# EasyEDA schematic SCH_Voltage Regulator_2023-12-21.json
TITLE: Sheet_1; REV: 1.0; Date: 2023-12-19; Sheet: 1/1; Drawn By: nehafrancis2003; Company: Your Company
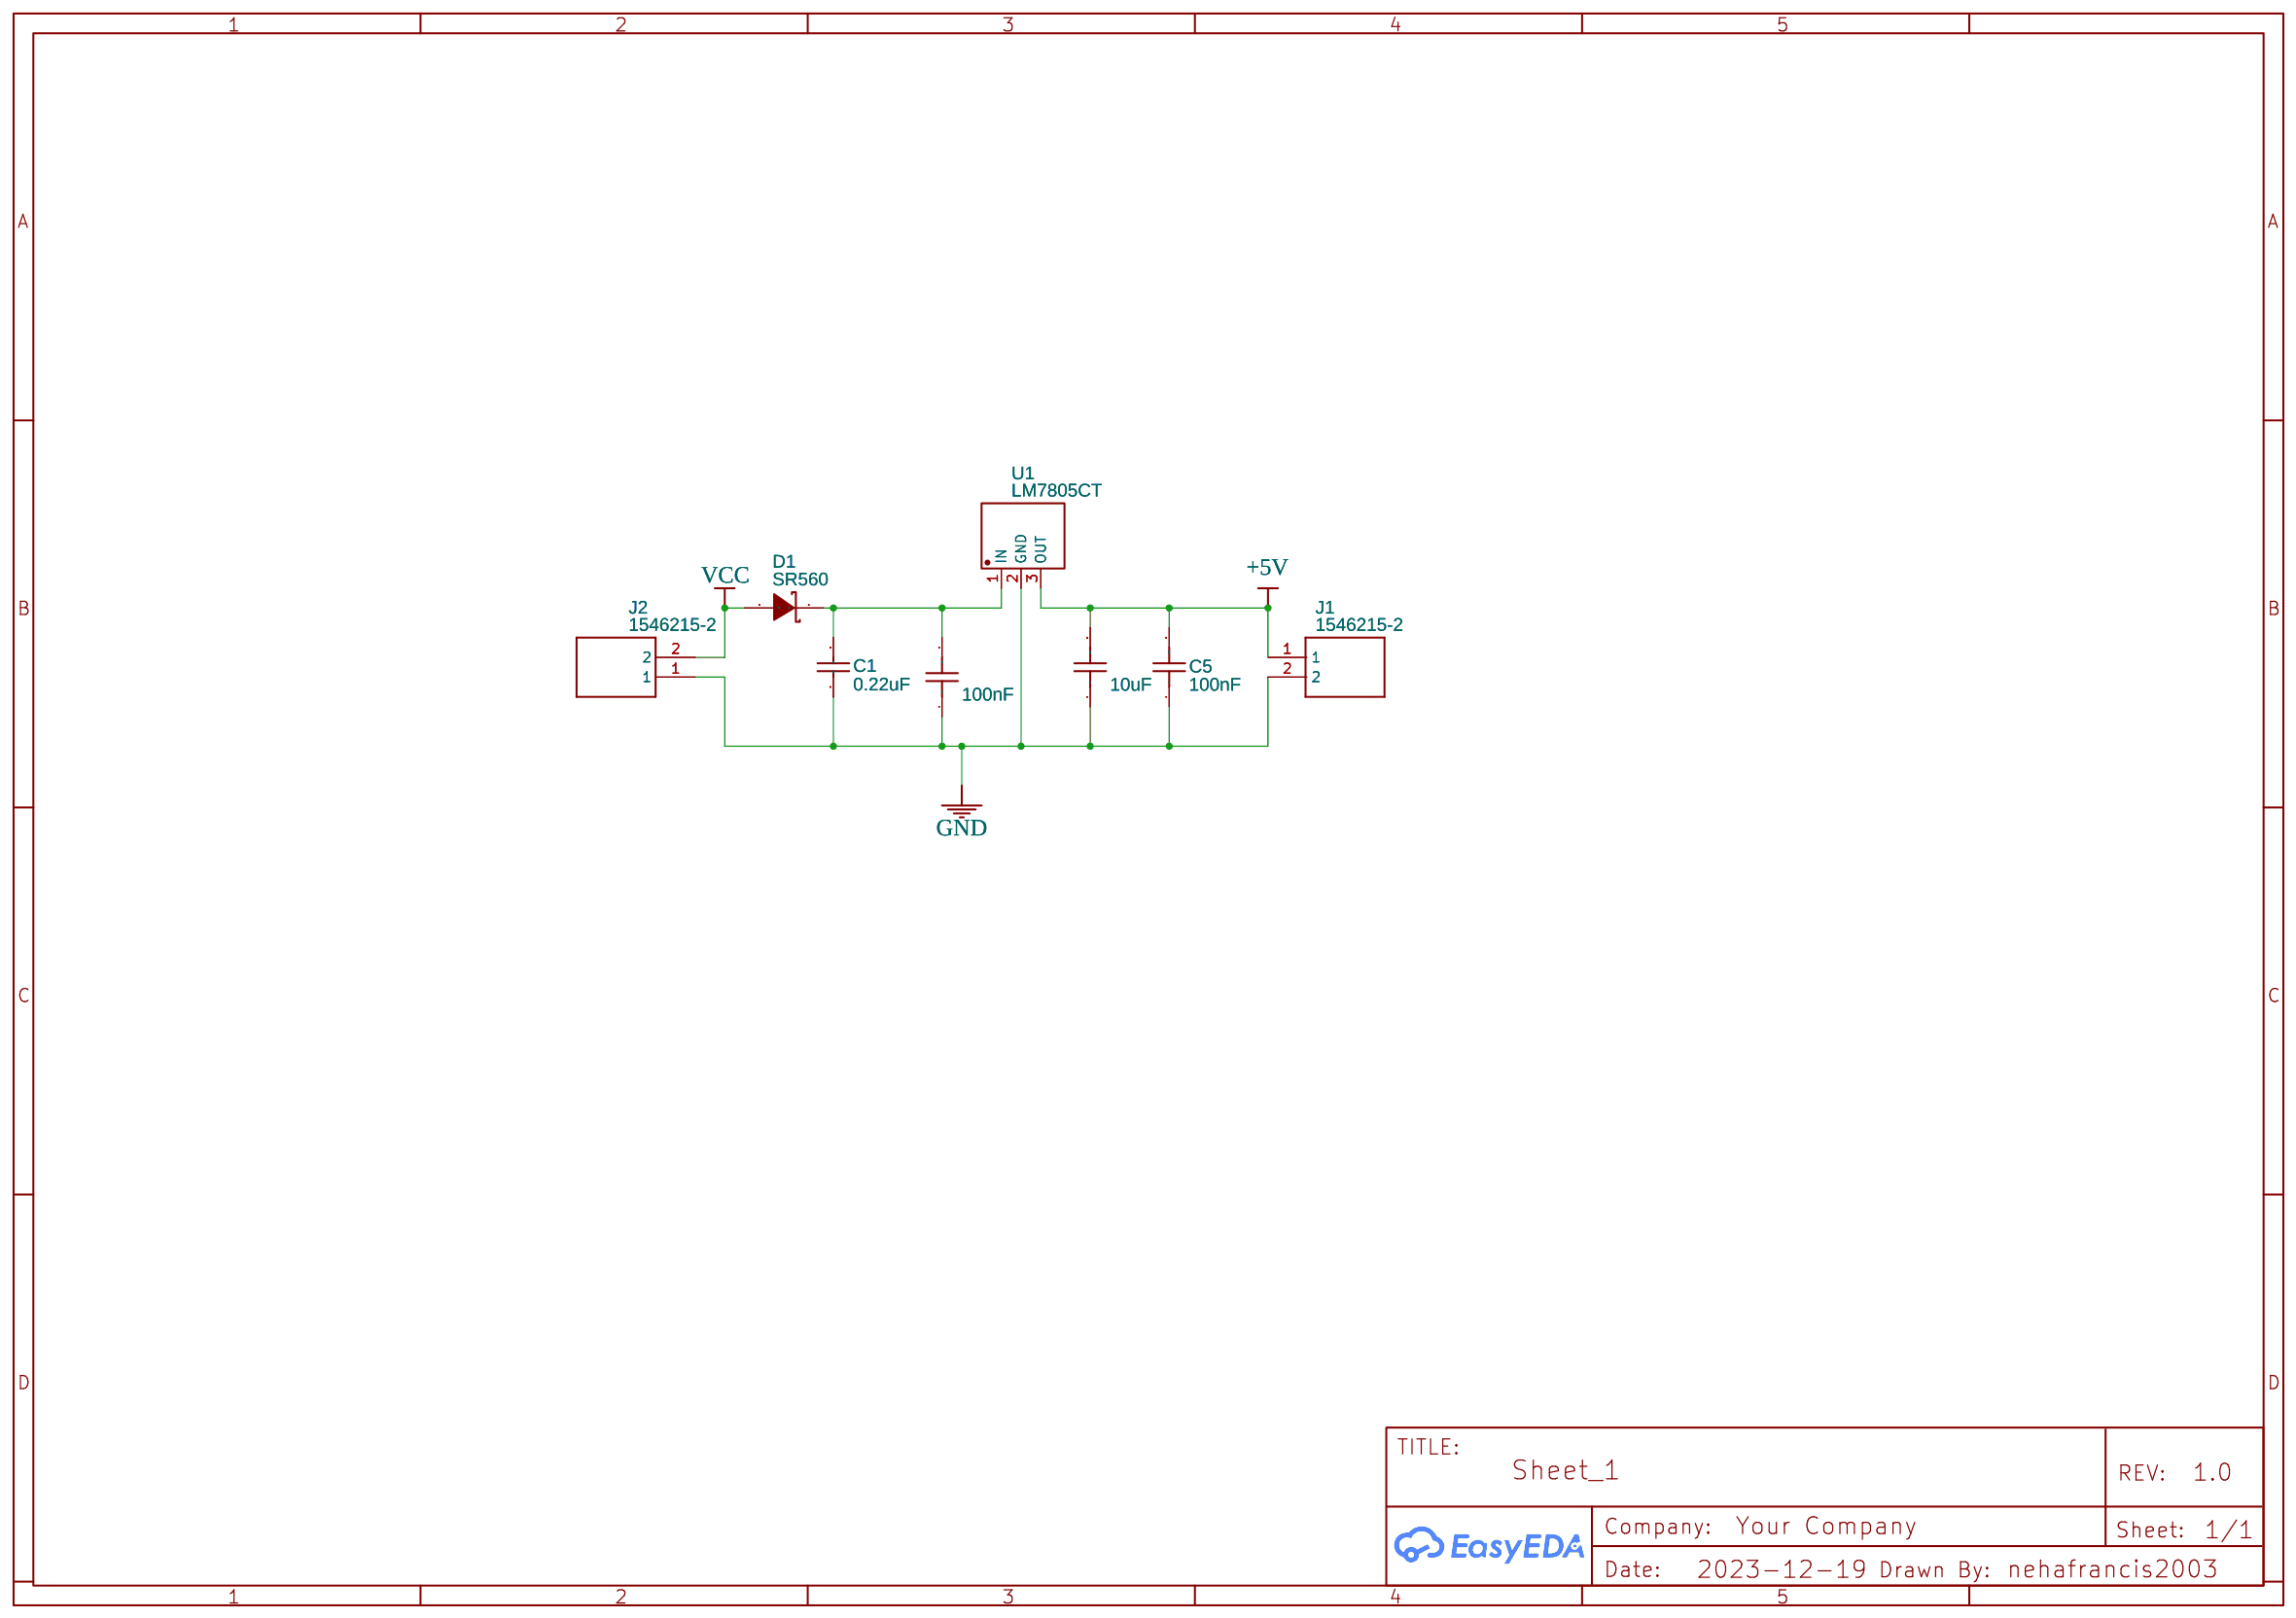
[diagram p0: schematic sheet]

## Parts
C1  0.22uF  [RAD-0.2]
C2  100nF  [CAP-TH_L4.8-W3.2-P5.08-D1.2]
C5  100nF  [CAP-TH_L4.8-W3.2-P5.08-D1.2]
C6  10uF  [CAP-TH_L5.5-W4.0-P2.50-D0.5]
D1  SR560  [DO-201AD_BD5.3-L8.4-P12.50-D1.4-FD]
J1  1546215-2  [15462152]
J2  1546215-2  [15462152]
U1  LM7805CT  [TO-220-3_L10.0-W4.5-P2.54-L]

## Library data of the parts
C1 = CT4-0805Y224M500: Supplier Part: C32113; Supplier: LCSC; Manufacturer: ReliaPro
C2 C5 = CT4G-0805-2X1-50V-0.1UF-K: Contributor: LCSC; Supplier: LCSC; Supplier Part: C141981; Manufacturer: TORCH(火炬); Manufacturer Part: CT4G-0805-2X1-50V-0.1μF-K; JLCPCB Part Class: Extended Part
C6 = FK11X7R1C106MR006: Contributor: lcsc; Supplier: LCSC; Supplier Part: C3689237; Manufacturer: TDK
D1 = SR560: Supplier: LCSC; Manufacturer: MDD; Supplier Part: C38272; JLCPCB Part Class: Extended Part
J1 J2 = 1546215-2: Contributor: rueco
U1 = LM7805CT: Supplier: LCSC; Manufacturer: onsemi(安森美); Supplier Part: C22146; JLCPCB Part Class: Extended Part

## Nets
+5V: C5.2 C6.2 J1.1 U1.3(OUT)
GND: C1.2 C2.1 C5.1 C6.1 J1.2 J2.1 U1.2(GND)
VCC: D1.1(A) J2.2
Net-(C1-1): C1.1 C2.2 D1.2(K) U1.1(IN)
